# EAGLE design Prop Module (EAGLE 8.3.1)
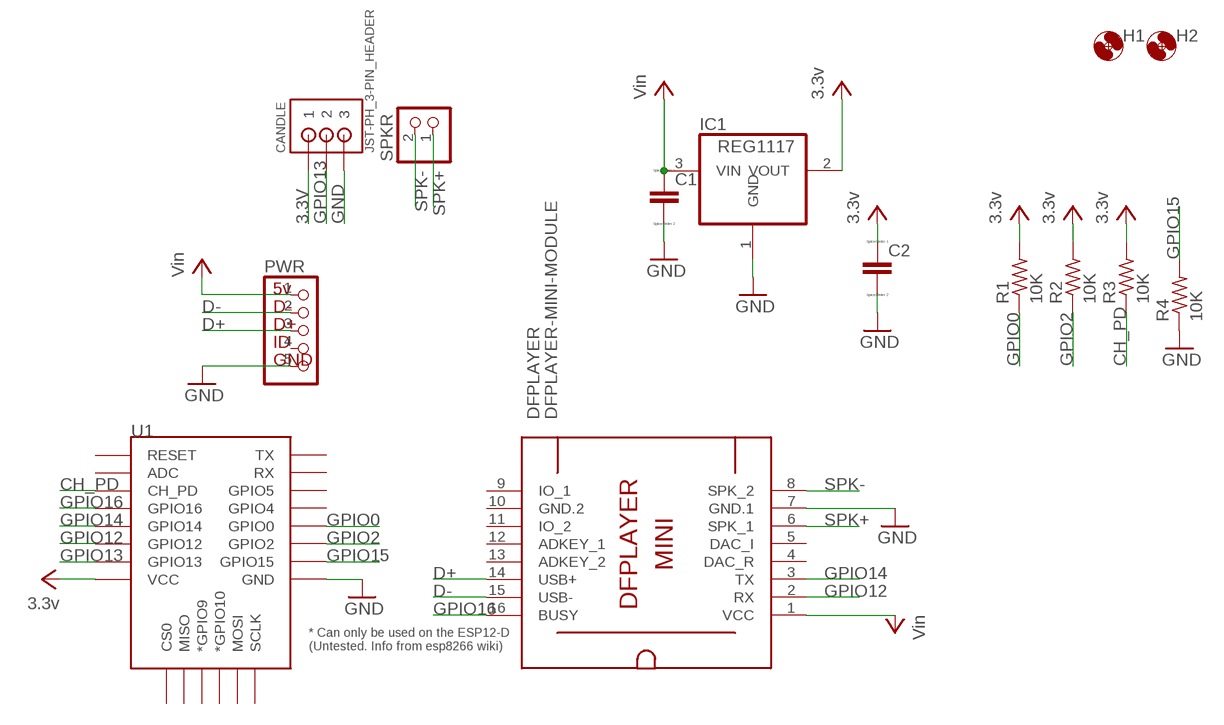
[diagram p0: schematic, sheet 1]

## Parts
C1  C  [C0805]
C2  C  [C0805]
CANDLE  JST-PH_3-PIN_HEADER  [JST_B3B-PH_HEADER]
DFPLAYER  DFPLAYER-MINI-MODULE  [DFPLAYER-MINI-MODULE]
H1  MOUNT-HOLE3.2  [3,2]
H2  MOUNT-HOLE3.2  [3,2]
IC1  REG1117  [SOT223]
PWR  USB_BRK-1X5  [1X05]
R1  10K  R-US_M1206  [M1206]
R2  10K  R-US_M1206  [M1206]
R3  10K  R-US_M1206  [M1206]
R4  10K  R-US_M1206  [M1206]
SPKR  JST_2PIN-THM  [JST-PH-2-THM]
U1  ESP12ESMD  [ESP12E-SMD]

## Nets
3.3V: C2.1 CANDLE.P1 IC1.2(VOUT) R1.2 R2.2 R3.2 U1.VCC ; supply symbol labelled 3.3v
CH_PD: R3.1 U1.CH_PD
D+: DFPLAYER.14(USB+) PWR.3
D-: DFPLAYER.15(USB-) PWR.2
GND: C1.2 C2.2 CANDLE.P3 DFPLAYER.7(GND.1) IC1.1(GND) PWR.5 R4.1 U1.GND
GPIO0: R1.1 U1.GPIO0
GPIO2: R2.1 U1.GPIO2
GPIO12: DFPLAYER.2(RX) U1.GPIO12
GPIO13: CANDLE.P2 U1.GPIO13
GPIO14: DFPLAYER.3(TX) U1.GPIO14
GPIO15: R4.2 U1.GPIO15
GPIO16: DFPLAYER.16(BUSY) U1.GPIO16
SPK+: DFPLAYER.6(SPK_1) SPKR.1
SPK-: DFPLAYER.8(SPK_2) SPKR.2
VIN: C1.1 DFPLAYER.1(VCC) IC1.3(VIN) PWR.1 ; supply symbol labelled Vin
Unconnected: DFPLAYER.4(DAC_R) DFPLAYER.5(DAC_I) DFPLAYER.9(IO_1) DFPLAYER.11(IO_2) DFPLAYER.12(ADKEY_1) DFPLAYER.13(ADKEY_2) PWR.4 U1.ADC U1.CS0 U1.GPIO4 U1.GPIO5 U1.GPIO9(*GPIO9) U1.GPIO10(*GPIO10) U1.MISO U1.MOSI U1.RESET U1.RXD0(RX) U1.SCLK U1.TXD0(TX)

## Power pins joined to a net without a drawn wire
GND.2: DFPLAYER.10(GND.2)

## Library data of the parts
C1 C2 = eagle-ltspice:C: CAPACITOR, European symbol; SPICEMODEL: NONE; SPICEPREFIX: C
CANDLE = srg:JST-PH_3-PIN_HEADER: 3-pin JST PH Shrouded Header, top entry P/N B3B-PH-K-S Mating connector PHR-3
DFPLAYER = diy-modules:DFPLAYER-MINI-MODULE: DFPlayer Mini - MP3 player module based on YX5200 chip More details available here: https://www.dfrobot.com/wiki/index.php/DFPlayer_Mini_SKU:DFR0299 Click here to find device on ebay.com <http://www.ebay.com/sch/dfplayer+mini>
H1 H2 = holes:MOUNT-HOLE: MOUNTING HOLE with drill center marker
IC1 = burr-brown:REG1117: 800mA and 1A Low Dropout (LDO) Positive Regulator 1.8V, 2.5V, 2.85V, 3.3V, 5V, and Adj; MPN: REG1117; OC_FARNELL: 1097566; OC_NEWARK: 14P6981
PWR = IGetIO:USB_BRK-1X5: PIN HEADER
R1-R4 = resistor:R-US_: RESISTOR, American symbol
SPKR = adafruit:JST_2PIN: JST 2-Pin Connectors of various flavors SMT-RA (S2B-PH-SM4) 4UConnector #17311 SMT (B2B-PH-SM4) THM-RA (S2B-PH) THM (B2B-PH)
U1 = esp8266modules:ESP12E: ESP12E Module

## Board
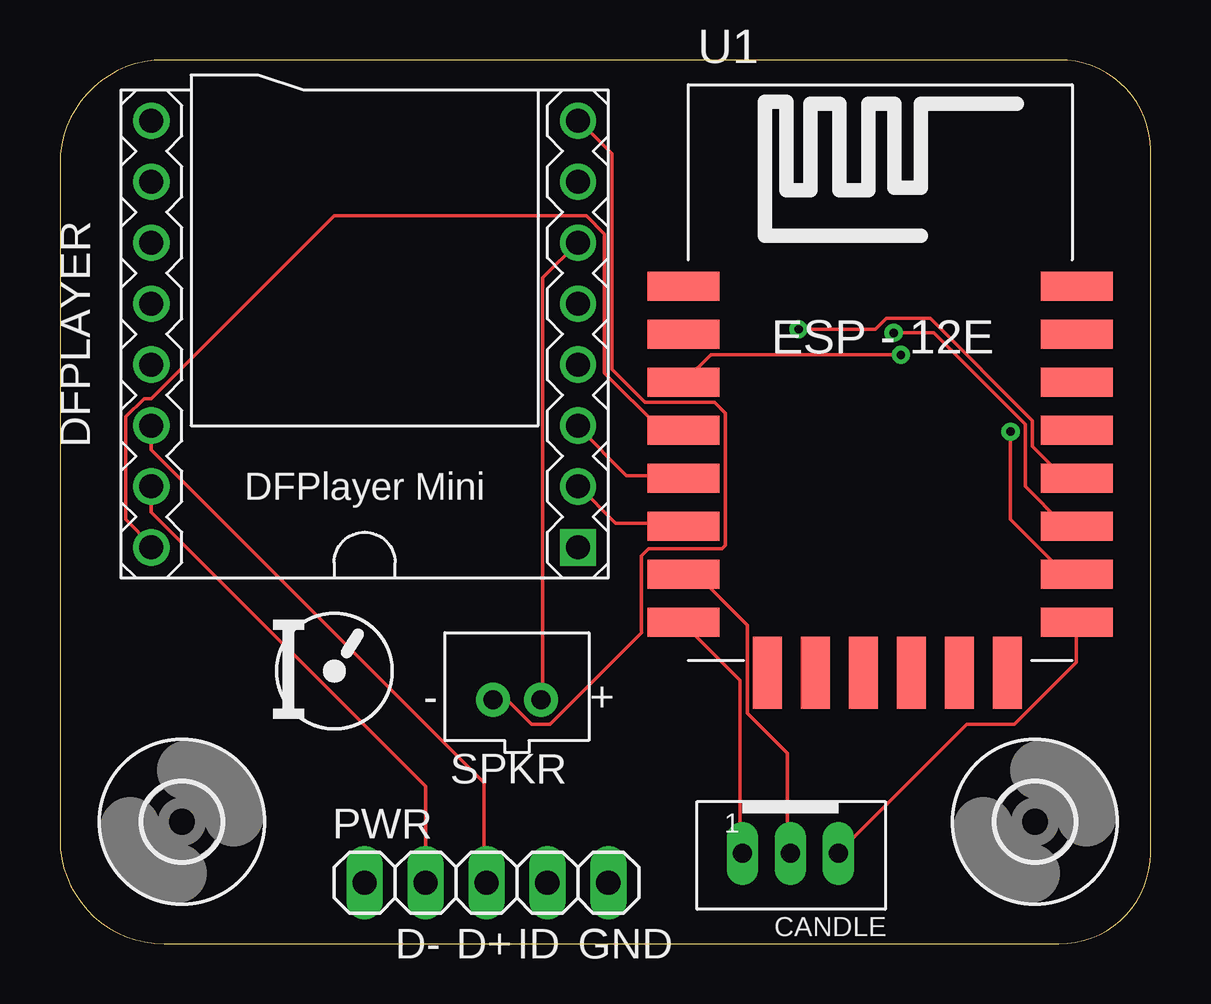
[diagram p1: board, top side]
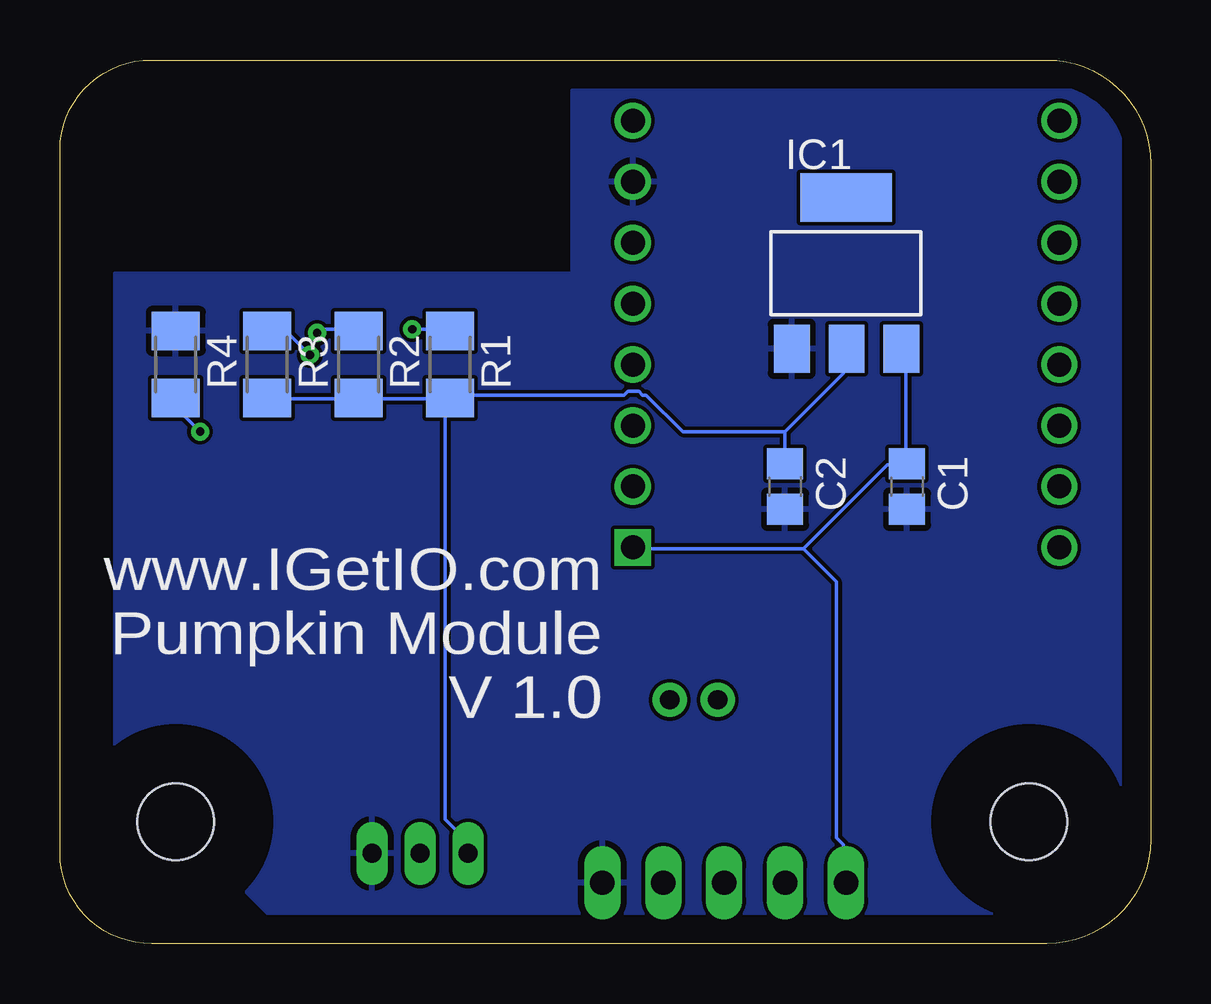
[diagram p2: board, bottom side, seen from below]

Size 45.47 x 36.82 mm. Coordinates in mm from the lower left corner, seen from the top.
Outline: 4.34,0 41.63,0 arc90 45.47,3.75 45.47,33.08 arc90 41.65,36.82 4.32,36.82 arc90 0,32.5 0,4.34 arc90 4.34,0
Copper layers (1*16): Top 0.035mm / dielectric 1.5mm / Bottom 0.035mm
Design rules "default": minimum track width 6mil, minimum drill 0.35mm, track to track 6mil, track to pad 6mil, pad to pad 6mil, via to via 6mil, smd to smd 6mil, copper to edge 40mil, drill to drill 6mil, minimum pad ring 10mil, minimum via ring 8mil, stop-mask expansion 4mil, vias tented up to drill 0mil, thermal gap 10mil

### Footprints (pad centres in the part's own frame; a part is rotated, then mirrored left to right if it is on the bottom)
C0805 = smd 1.3 x 1.5: 1 -0.95,0; 2 0.95,0
JST_B3B-PH_HEADER = drill 0.8 long: P1 2.027,0.048; P2 0.028,0.048; P3 -1.972,0.048
DFPLAYER-MINI-MODULE = drill 1 square: 1 -8.89,-8.89 | drill 1: 2 -6.35,-8.89; 3 -3.81,-8.89; 4 -1.27,-8.89; 5 1.27,-8.89; 6 3.81,-8.89; 7 6.35,-8.89; 8 8.89,-8.89; 9 8.89,8.89; 10 6.35,8.89; 11 3.81,8.89; 12 1.27,8.89; 13 -1.27,8.89; 14 -3.81,8.89; 15 -6.35,8.89; 16 -8.89,8.89
3,2 = hole 3.2: 0,0
SOT223 = smd 1.499 x 2.007: 1 -2.261,-3.15; 2 0.025,-3.15; 3 2.311,-3.15 | smd 3.81 x 2.007: 4 0,3.15
1X05 = drill 1.016 long: 1 -5.08,0; 2 -2.54,0; 3 0,0; 4 2.54,0; 5 5.08,0
M1206 = smd 1.6 x 2: 1 -1.4,0; 2 1.4,0
JST-PH-2-THM = drill 0.8 pad 1.422: 1 1,0; 2 -1,0
ESP12E-SMD = smd 3 x 1.2: ADC -8.3,3.8; CH_PD -8.3,1.8; GND 8.1,-8.2; GPIO0 8.1,-2.2; GPIO2 8.1,-4.2; GPIO4 8.1,-0.2; GPIO5 8.1,1.8; GPIO12 -8.3,-4.2; GPIO13 -8.3,-6.2; GPIO14 -8.3,-2.2; GPIO15 8.1,-6.2; GPIO16 -8.3,-0.2; RESET -8.3,5.8; RXD0 8.1,3.8; TXD0 8.1,5.8; VCC -8.3,-8.2 | smd 1.2 x 3: CS0 -4.8,-10.3; GPIO9 -0.8,-10.3; GPIO10 1.2,-10.3; MISO -2.8,-10.3; MOSI 3.2,-10.3; SCLK 5.2,-10.3

### Placement (x,y rotation side)
C1  10.16,19.05 270 bottom
C2  15.24,19.05 270 bottom
CANDLE  30.48,3.81 180 top
DFPLAYER  12.7,25.4 90 top
H1  5.08,5.08 0 top
H2  40.64,5.08 0 top
IC1  12.7,27.94 0 bottom
PWR  17.78,2.54 0 top
R1  29.21,24.13 270 bottom
R2  33.02,24.13 270 bottom
R3  36.83,24.13 270 bottom
R4  40.64,24.13 270 bottom
SPKR  19.05,10.16 0 top
U1  34.29,21.59 0 top
U$1  [IGETIO-0.33]  8.89,8.89 0 top

### Tracks (layer width: path | path; a pad name or v marks a point on that pad's centre or on a via)
3.3V
  Top 0.152: CANDLE.P1 28.35,3.81 28.35,10.97 26.06,13.26 U1.VCC
  Bottom 0.152: 15.24,21.34 C2.1 | 15.24,21.34 12.8,23.77 12.8,24.69 IC1.2 | 29.41,22.71 32.92,22.71 R2.2 33.07,22.71 36.73,22.71 R3.2 | 29.41,22.71 29.26,22.71 R1.2 | 15.24,21.34 19.51,21.34 21.03,22.86 21.18,22.86 21.34,23.01 21.79,23.01 21.95,22.86 29.11,22.86 R1.2 | 29.41,22.71 29.41,5.18 28.5,4.27 28.5,3.81 CANDLE.P1 | 29.41,22.71 R1.2
CH_PD  (via drill 0.35)
  Top 0.152: v35.05,24.54 27.13,24.54 26.06,23.47 U1.CH_PD
  Bottom 0.152: v35.05,24.54 35.97,25.45 36.73,25.45 R3.1
D+
  Top 0.152: DFPLAYER.14 3.81,20.57 17.68,6.71 17.68,2.59 PWR.3
D-
  Top 0.152: DFPLAYER.15 3.81,17.98 15.24,6.55 PWR.2
GND
  Top 0.152: U1.GND 42.37,13.26 42.37,11.73 39.78,9.14 37.8,9.14 32.46,3.81 CANDLE.P3
  pour Bottom: 1.27,34.29 2.54,35.56 24.13,35.56 24.13,27.94 43.18,27.94 43.18,7.62 36.83,1.27 6.35,1.27 1.27,6.35
GPIO0  (via drill 0.35)
  Top 0.152: v30.79,25.6 33.98,25.6 34.44,26.06 36.27,26.06 40.54,21.79 40.54,20.73 41.76,19.51 42.37,19.51 U1.GPIO0
  Bottom 0.152: v30.79,25.6 29.26,25.6 R1.1
GPIO2  (via drill 0.35)
  Top 0.152: v34.75,25.45 36.42,25.45 40.23,21.64 40.23,19.05 41.76,17.53 42.37,17.53 U1.GPIO2
  Bottom 0.152: v34.75,25.45 34.59,25.6 33.07,25.6 R2.1
GPIO12
  Top 0.152: U1.GPIO12 25.91,17.53 23.16,17.53 21.64,19.05 DFPLAYER.2
GPIO13
  Top 0.152: CANDLE.P2 30.33,3.81 30.33,7.92 28.65,9.6 28.65,13.26 26.67,15.24 26.06,15.24 U1.GPIO13
GPIO14
  Top 0.152: U1.GPIO14 25.91,19.51 23.62,19.51 21.64,21.49 DFPLAYER.3
GPIO15  (via drill 0.35)
  Top 0.152: v39.62,21.34 39.62,17.68 41.91,15.39 42.37,15.39 U1.GPIO15
  Bottom 0.152: v39.62,21.34 40.54,22.25 40.54,22.71 R4.2
GPIO16
  Top 0.152: U1.GPIO16 25.91,21.49 24.99,21.49 22.71,23.77 22.71,29.57 21.95,30.33 11.43,30.33 3.81,22.71 3.5,22.71 2.74,21.95 2.74,17.68 3.81,16.61 DFPLAYER.16
SPK+
  Top 0.152: DFPLAYER.6 20.12,27.74 20.12,10.21 SPKR.1
SPK-
  Top 0.152: SPKR.2 18.14,10.06 18.75,10.06 19.66,9.14 20.42,9.14 24.23,12.95 24.23,16.15 24.54,16.46 27.58,16.46 27.74,16.61 27.74,22.1 27.28,22.55 24.38,22.55 23.01,23.93 23.01,32.92 21.64,34.29 DFPLAYER.8
VIN
  Bottom 0.152: IC1.3 10.36,24.69 10.21,24.54 10.21,20.12 C1.1 10.21,19.96 10.97,19.96 14.48,16.46 | 14.48,16.46 21.49,16.46 DFPLAYER.1 | 14.48,16.46 13.11,15.09 13.11,4.42 12.8,4.12 12.8,2.59 PWR.1

### Text on the board
bPlace: www.IGetIO.com / Pumpkin Module / V 1.0